# Altium project Main Board.PrjPcb
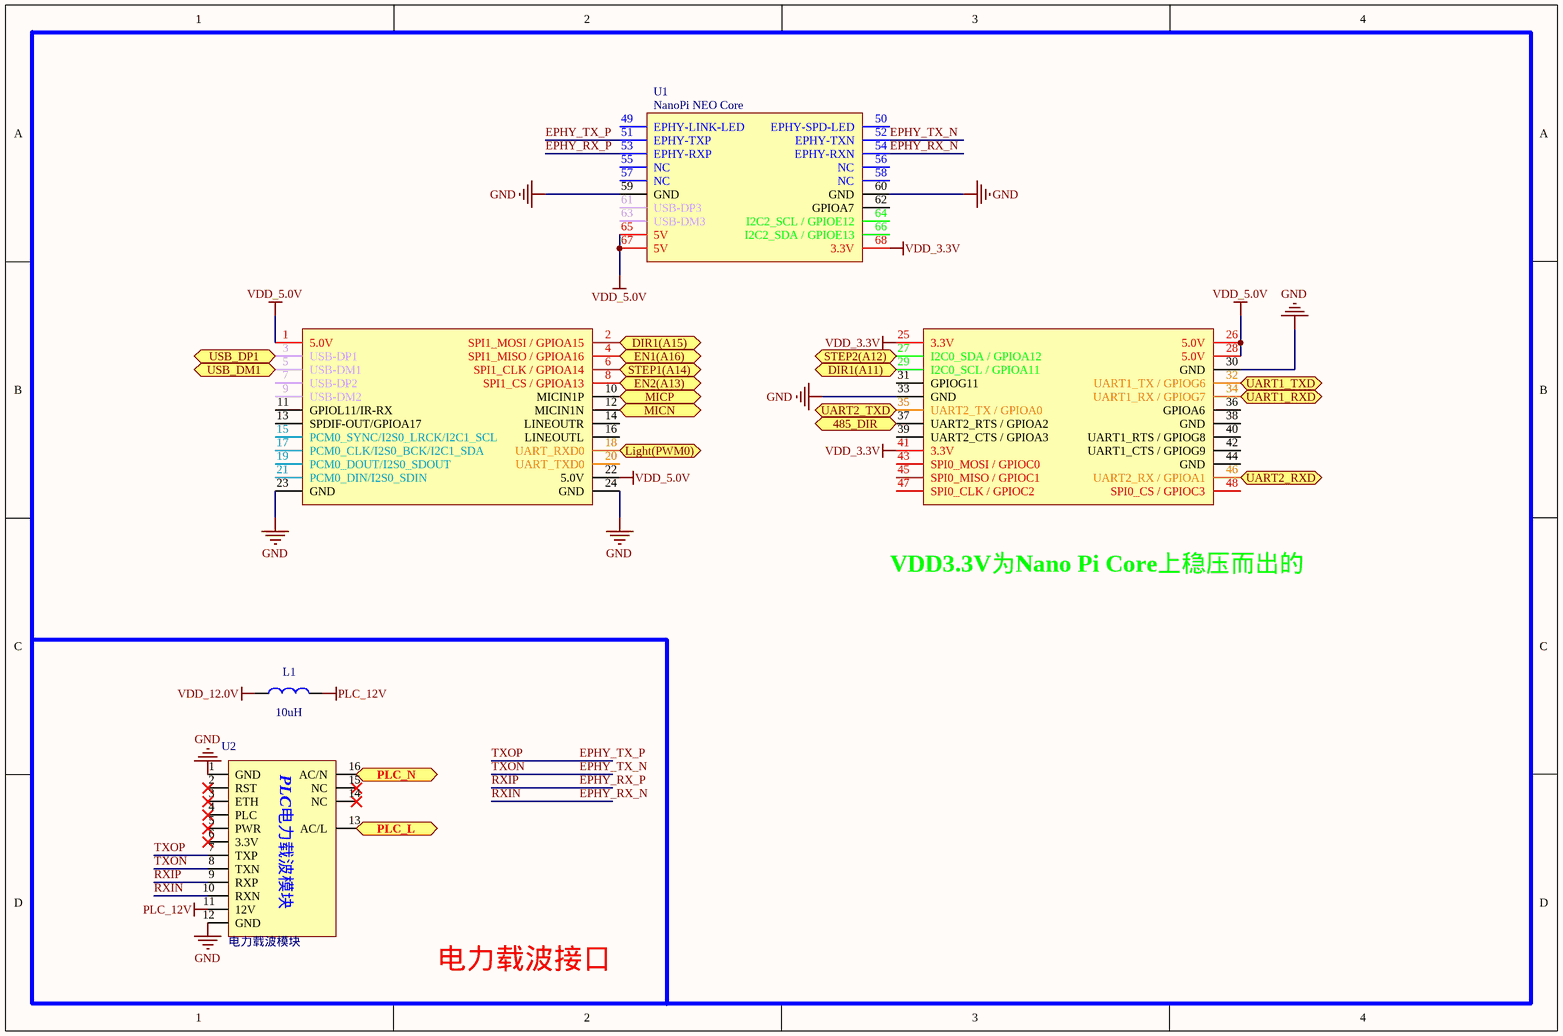
[diagram p0: core.SchDoc]
2 sheets, 37 parts. Net scope: flat (ports and power ports of the same name join across sheets).
Board file: main_board.PcbDoc
Sheets:
  core.SchDoc
  devices.SchDoc

## Sheet core.SchDoc
size A4

### Parts
L1  10uH  [1206L]
U1  NanoPi NEO Core  [NanoPi NEO Core]
U2  电力载波模块  [电力载波模块6410(贴片版)]

### Ports
485_DIR, DIR1(A11), DIR1(A15), EN1(A16), EN2(A13), Light(PWM0), MICN, MICP, PLC_L, PLC_N, STEP1(A14), STEP2(A12), UART1_RXD, UART1_TXD, UART2_RXD, UART2_TXD, USB_DM1, USB_DP1

### Nets
GND: U1.23(GND) U1.24(GND) U1.30(GND) U1.33(GND) U1.59(GND) U1.60(GND) U2.1(GND) U2.12(GND) U2.16(AC/N) ; port PLC_N
PLC_12V: L1.2 U2.11(12V)
VDD_3.3V: U1.25(3.3V) U1.41(3.3V) U1.68(3.3V)
VDD_5.0V: U1.1(5.0V) U1.22(5.0V) U1.26(5.0V) U1.28(5.0V) U1.65(5V) U1.67(5V)
VDD_12.0V: L1.1
VDD_24.0V: U2.13(AC/L) ; port PLC_L
485_DIR: U1.37(UART2_RTS_/_GPIOA2) ; port 485_DIR
DIR1(A11): U1.29(I2C0_SCL_/_GPIOA11) ; port DIR1(A11)
DIR1(A15): U1.2(SPI1_MOSI_/_GPIOA15) ; port DIR1(A15)
EN1(A16): U1.4(SPI1_MISO_/_GPIOA16) ; port EN1(A16)
EN2(A13): U1.8(SPI1_CS_/_GPIOA13) ; port EN2(A13)
EPHY_RX_N: U1.54(EPHY-RXN) U2.10(RXN)  [also labelled RXIN]
EPHY_RX_P: U1.53(EPHY-RXP) U2.9(RXP)  [also labelled RXIP]
EPHY_TX_N: U1.52(EPHY-TXN) U2.8(TXN)  [also labelled TXON]
EPHY_TX_P: U1.51(EPHY-TXP) U2.7(TXP)  [also labelled TXOP]
Light(PWM0): U1.18(UART_RXD0) ; port Light(PWM0)
MICN: U1.12(MICIN1N) ; port MICN
MICP: U1.10(MICIN1P) ; port MICP
STEP1(A14): U1.6(SPI1_CLK_/_GPIOA14) ; port STEP1(A14)
STEP2(A12): U1.27(I2C0_SDA_/_GPIOA12) ; port STEP2(A12)
UART1_RXD: U1.34(UART1_RX_/_GPIOG7) ; port UART1_RXD
UART1_TXD: U1.32(UART1_TX_/_GPIOG6) ; port UART1_TXD
UART2_RXD: U1.46(UART2_RX_/_GPIOA1) ; port UART2_RXD
UART2_TXD: U1.35(UART2_TX_/_GPIOA0) ; port UART2_TXD
USB_DM1: U1.5(USB-DM1) ; port USB_DM1
USB_DP1: U1.3(USB-DP1) ; port USB_DP1

Not connected (* = marked no-connect by the designer): U1 7(USB-DP2) 9(USB-DM2) 11(GPIOL11/IR-RX) 13(SPDIF-OUT/GPIOA17) 14(LINEOUTR) 15(PCM0_SYNC/I2S0_LRCK/I2C1_SCL) 16(LINEOUTL) 17(PCM0_CLK/I2S0_BCK/I2C1_SDA) 19(PCM0_DOUT/I2S0_SDOUT) 20(UART_TXD0) 21(PCM0_DIN/I2S0_SDIN) 31(GPIOG11) 36(GPIOA6) 38(GND) 39(UART2_CTS_/_GPIOA3) 40(UART1_RTS_/_GPIOG8) 42(UART1_CTS_/_GPIOG9) 43(SPI0_MOSI_/_GPIOC0) 44(GND) 45(SPI0_MISO_/_GPIOC1) 47(SPI0_CLK_/_GPIOC2) 48(SPI0_CS_/_GPIOC3) 49(EPHY-LINK-LED) 50(EPHY-SPD-LED) 55(NC) 56(NC) 57(NC) 58(NC) 61(USB-DP3) 62(GPIOA7) 63(USB-DM3) 64(I2C2_SCL_/_GPIOE12) 66(I2C2_SDA_/_GPIOE13); U2 2(RST)* 3(ETH)* 4(PLC)* 5(PWR)* 6(3.3V)* 14(NC)* 15(NC)*

### Notes on the sheet
- VDD3.3V为Nano Pi Core上稳压而出的
- 电力载波接口
- (in symbol 电力载波模块6410) PLC电力载波模块

### Library data of the parts
L1 = L: 电感
U2 = 电力载波模块6410

## Sheet devices.SchDoc
size A4
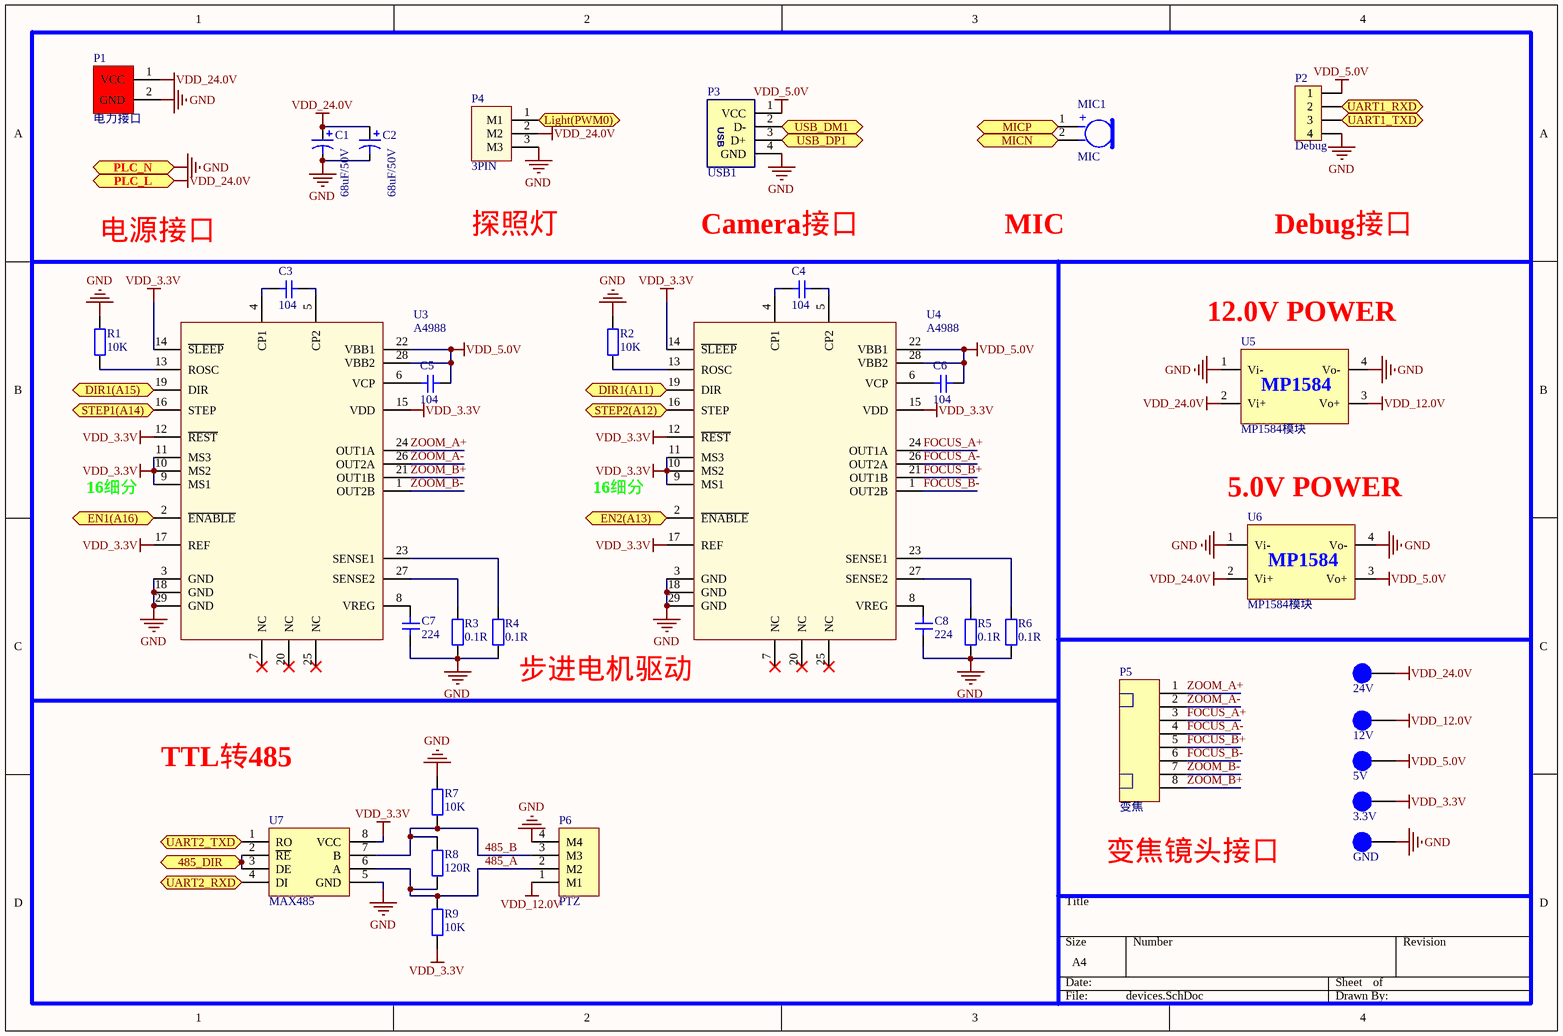
[diagram p1: devices.SchDoc]

### Parts
C1  68uF/50V  [RB.1.2]
C2  68uF/50V  [RB.1.2]
C3  104  [0603C]
C4  104  [0603C]
C5  104  [0603C]
C6  104  [0603C]
C7  224  [0603C]
C8  224  [0603C]
MIC1  MIC  [MIC]
P1  电力接口  [PH2.0WS-2P]
P2  Debug  [MX1.25WS-4PIN]
P3  USB1  [PH2.0WS-4P]
P4  3PIN  [PH2.0WS-3P]
P5  变焦  [MX1.25WS-8P]
P6  PTZ  [PH2.0WS-4P]
R1  10K  [0603R]
R2  10K  [0603R]
R3  0.1R  [0805R]
R4  0.1R  [0805R]
R5  0.1R  [0805R]
R6  0.1R  [0805R]
R7  10K  [0603R]
R8  120R  [0603R]
R9  10K  [0603R]
T1  24V  [PIN 1(贴片)]
T2  12V  [PIN 1(贴片)]
T3  5V  [PIN 1(贴片)]
T4  3.3V  [PIN 1(贴片)]
T5  GND  [PIN 1(贴片)]
U3  A4988  [QFN-28]
U4  A4988  [QFN-28]
U5  MP1584模块  [MP1584电源模块]
U6  MP1584模块  [MP1584电源模块]
U7  MAX485  [SOP-8]

### Ports
485_DIR, DIR1(A11), DIR1(A15), EN1(A16), EN2(A13), Light(PWM0), MICN, MICP, PLC_L, PLC_N, STEP1(A14), STEP2(A12), UART1_RXD, UART1_TXD, UART2_RXD, UART2_TXD, USB_DM1, USB_DP1

### Nets
GND: C1.2 C2.2 C7.1 C8.1 P1.2(GND) P2.4 P3.4(GND) P4.3(M3) P6.4(M4) R1.1 R2.1 R3.1 R4.1 R5.1 R6.1 R7.2 T5.1 U3.3(GND) U3.18(GND) U3.29(GND) U4.3(GND) U4.18(GND) U4.29(GND) U5.1(Vi-) U5.4(Vo-) U6.1(Vi-) U6.4(Vo-) U7.5(GND) ; port PLC_N
VDD_3.3V: R9.1 T4.1 U3.9(MS1) U3.10(MS2) U3.11(MS3) U3.12(~{REST}) U3.14(~{SLEEP}) U3.15(VDD) U3.17(REF) U4.9(MS1) U4.10(MS2) U4.11(MS3) U4.12(~{REST}) U4.14(~{SLEEP}) U4.15(VDD) U4.17(REF) U7.8(VCC)
VDD_5.0V: C5.2 C6.2 P2.1 P3.1(VCC) T3.1 U3.22(VBB1) U3.28(VBB2) U4.22(VBB1) U4.28(VBB2) U6.3(Vo+)
VDD_12.0V: P6.1(M1) T2.1 U5.3(Vo+)
VDD_24.0V: C1.1 C2.1 P1.1(VCC) P4.2(M2) T1.1 U5.2(Vi+) U6.2(Vi+) ; port PLC_L
485_A: P6.2(M2) R8.1 R9.2 U7.6(A)
485_B: P6.3(M3) R7.1 R8.2 U7.7(B)
485_DIR: U7.2(~{RE}) U7.3(DE) ; port 485_DIR
DIR1(A11): U4.19(DIR) ; port DIR1(A11)
DIR1(A15): U3.19(DIR) ; port DIR1(A15)
EN1(A16): U3.2(~{ENABLE}) ; port EN1(A16)
EN2(A13): U4.2(~{ENABLE}) ; port EN2(A13)
FOCUS_A+: P5.3 U4.24(OUT1A)
FOCUS_A-: P5.4 U4.26(OUT2A)
FOCUS_B+: P5.5 U4.21(OUT1B)
FOCUS_B-: P5.6 U4.1(OUT2B)
Light(PWM0): P4.1(M1) ; port Light(PWM0)
MICN: MIC1.2(N) ; port MICN
MICP: MIC1.1(P) ; port MICP
STEP1(A14): U3.16(STEP) ; port STEP1(A14)
STEP2(A12): U4.16(STEP) ; port STEP2(A12)
UART1_RXD: P2.2 ; port UART1_RXD
UART1_TXD: P2.3 ; port UART1_TXD
UART2_RXD: U7.4(DI) ; port UART2_RXD
UART2_TXD: U7.1(RO) ; port UART2_TXD
USB_DM1: P3.2(D-) ; port USB_DM1
USB_DP1: P3.3(D+) ; port USB_DP1
ZOOM_A+: P5.1 U3.24(OUT1A)
ZOOM_A-: P5.2 U3.26(OUT2A)
ZOOM_B+: P5.8 U3.21(OUT1B)
ZOOM_B-: P5.7 U3.1(OUT2B)
NetC3_1: C3.1 U3.4(CP1)
NetC3_2: C3.2 U3.5(CP2)
NetC4_1: C4.1 U4.4(CP1)
NetC4_2: C4.2 U4.5(CP2)
NetC5_1: C5.1 U3.6(VCP)
NetC6_1: C6.1 U4.6(VCP)
NetC7_2: C7.2 U3.8(VREG)
NetC8_2: C8.2 U4.8(VREG)
NetR1_2: R1.2 U3.13(ROSC)
NetR2_2: R2.2 U4.13(ROSC)
NetR3_2: R3.2 U3.27(SENSE2)
NetR4_2: R4.2 U3.23(SENSE1)
NetR5_2: R5.2 U4.27(SENSE2)
NetR6_2: R6.2 U4.23(SENSE1)

Not connected (* = marked no-connect by the designer): U3 7(NC)* 20(NC)* 25(NC)*; U4 7(NC)* 20(NC)* 25(NC)*

### Notes on the sheet
- 电源接口
- 探照灯
- Camera接口
- MIC
- Debug接口
- (near U5) 12.0V POWER
- 16细分
- (near U6) 5.0V POWER
- (near R4) 步进电机驱动
- TTL转485
- (near P5) 变焦镜头接口
- (in symbol MIC) +
- (in symbol MP1584电源模块) MP1584

### Library data of the parts
C1 C2 = Cap3: 直插极性电容
C3-C8 = Cap1: 无极贴片电容
P1 = 电源端子
P2 = Header 4: 排针
P3 = USB
P4 = 接线端子-3PIN
P5 = 接线端子-8PIN
P6 = 接线端子-4PIN: 4PIN
R1-R9 = Res: 电阻
T1-T5 = 测试点
U5 U6 = MP1584电源模块

## Nets that join several sheets
GND: core (9 pins), devices (28 pins)
VDD_3.3V: core (U1.25 U1.41 U1.68), devices (17 pins)
VDD_5.0V: core (6 pins), devices (10 pins)
VDD_12.0V: core (L1.1), devices (P6.1 T2.1 U5.3)
VDD_24.0V: core (U2.13), devices (7 pins)
485_DIR: core (U1.37), devices (U7.2 U7.3)
DIR1(A11): core (U1.29), devices (U4.19)
DIR1(A15): core (U1.2), devices (U3.19)
EN1(A16): core (U1.4), devices (U3.2)
EN2(A13): core (U1.8), devices (U4.2)
Light(PWM0): core (U1.18), devices (P4.1)
MICN: core (U1.12), devices (MIC1.2)
MICP: core (U1.10), devices (MIC1.1)
STEP1(A14): core (U1.6), devices (U3.16)
STEP2(A12): core (U1.27), devices (U4.16)
UART1_RXD: core (U1.34), devices (P2.2)
UART1_TXD: core (U1.32), devices (P2.3)
UART2_RXD: core (U1.46), devices (U7.4)
UART2_TXD: core (U1.35), devices (U7.1)
USB_DM1: core (U1.5), devices (P3.2)
USB_DP1: core (U1.3), devices (P3.3)